# EAGLE design 7-Segment_display (EAGLE 9.6.2)
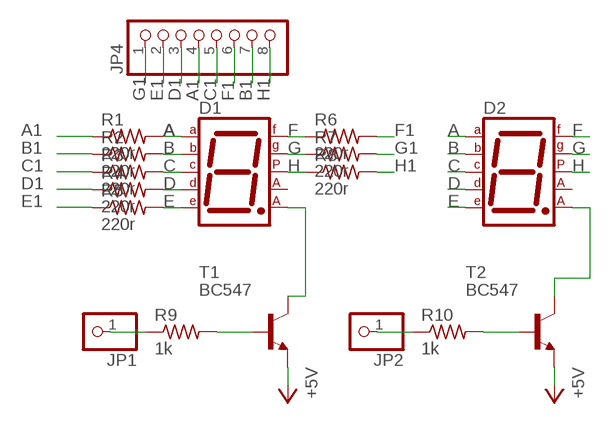
[diagram p0: schematic, sheet 1]

## Parts
D1  7SEG-CA  [7SEG-13]
D2  7SEG-CA  [7SEG-13]
JP1  PINHD-1X1  [1X01]
JP2  PINHD-1X1  [1X01]
JP4  PINHD-1X8  [1X08]
R1  220r  R-US_0207/10  [0207/10]
R2  220r  R-US_0207/10  [0207/10]
R3  220r  R-US_0207/10  [0207/10]
R4  220r  R-US_0207/10  [0207/10]
R5  220r  R-US_0207/10  [0207/10]
R6  220r  R-US_0207/10  [0207/10]
R7  220r  R-US_0207/10  [0207/10]
R8  220r  R-US_0207/10  [0207/10]
R9  1k  R-US_0207/10  [0207/10]
R10  1k  R-US_0207/10  [0207/10]
T1  BC547  [TO92]
T2  BC547  [TO92]

## Nets
+5V: T1.1(E) T2.1(E)
A: D1.7(A) D2.7(A) R1.2
A1: JP4.4 R1.1
B: D1.6(B) D2.6(B) R2.2
B1: JP4.7 R2.1
C: D1.4(C) D2.4(C) R3.2
C1: JP4.5 R3.1
D: D1.2(D) D2.2(D) R4.2
D1: JP4.3 R4.1
E: D1.1(E) D2.1(E) R5.2
E1: JP4.2 R5.1
F: D1.9(F) D2.9(F) R6.1
F1: JP4.6 R6.2
G: D1.10(G) D2.10(G) R7.1
G1: JP4.1 R7.2
H: D1.5(DP) D2.5(DP) R8.1
H1: JP4.8 R8.2
N$1: R9.2 T1.2(B)
N$2: D1.8(CA2) T1.3(C)
N$3: R10.2 T2.2(B)
N$4: D2.8(CA2) T2.3(C)
N$5: JP1.1 R9.1
N$6: JP2.1 R10.1
Unconnected: D1.3(CA1) D2.3(CA1)

## Library data of the parts
D1 D2 = special:7SEG-CA: 7-segment DISPLAY single anode, 13 mm
JP1 JP2 = pinhead:PINHD-1X1: PIN HEADER
JP4 = pinhead:PINHD-1X8: PIN HEADER
R1-R10 = rcl:R-US_: RESISTOR, American symbol; SPICEPREFIX: R
T1 T2 = transistor:BC547: NPN TRANSISTOR

## Board
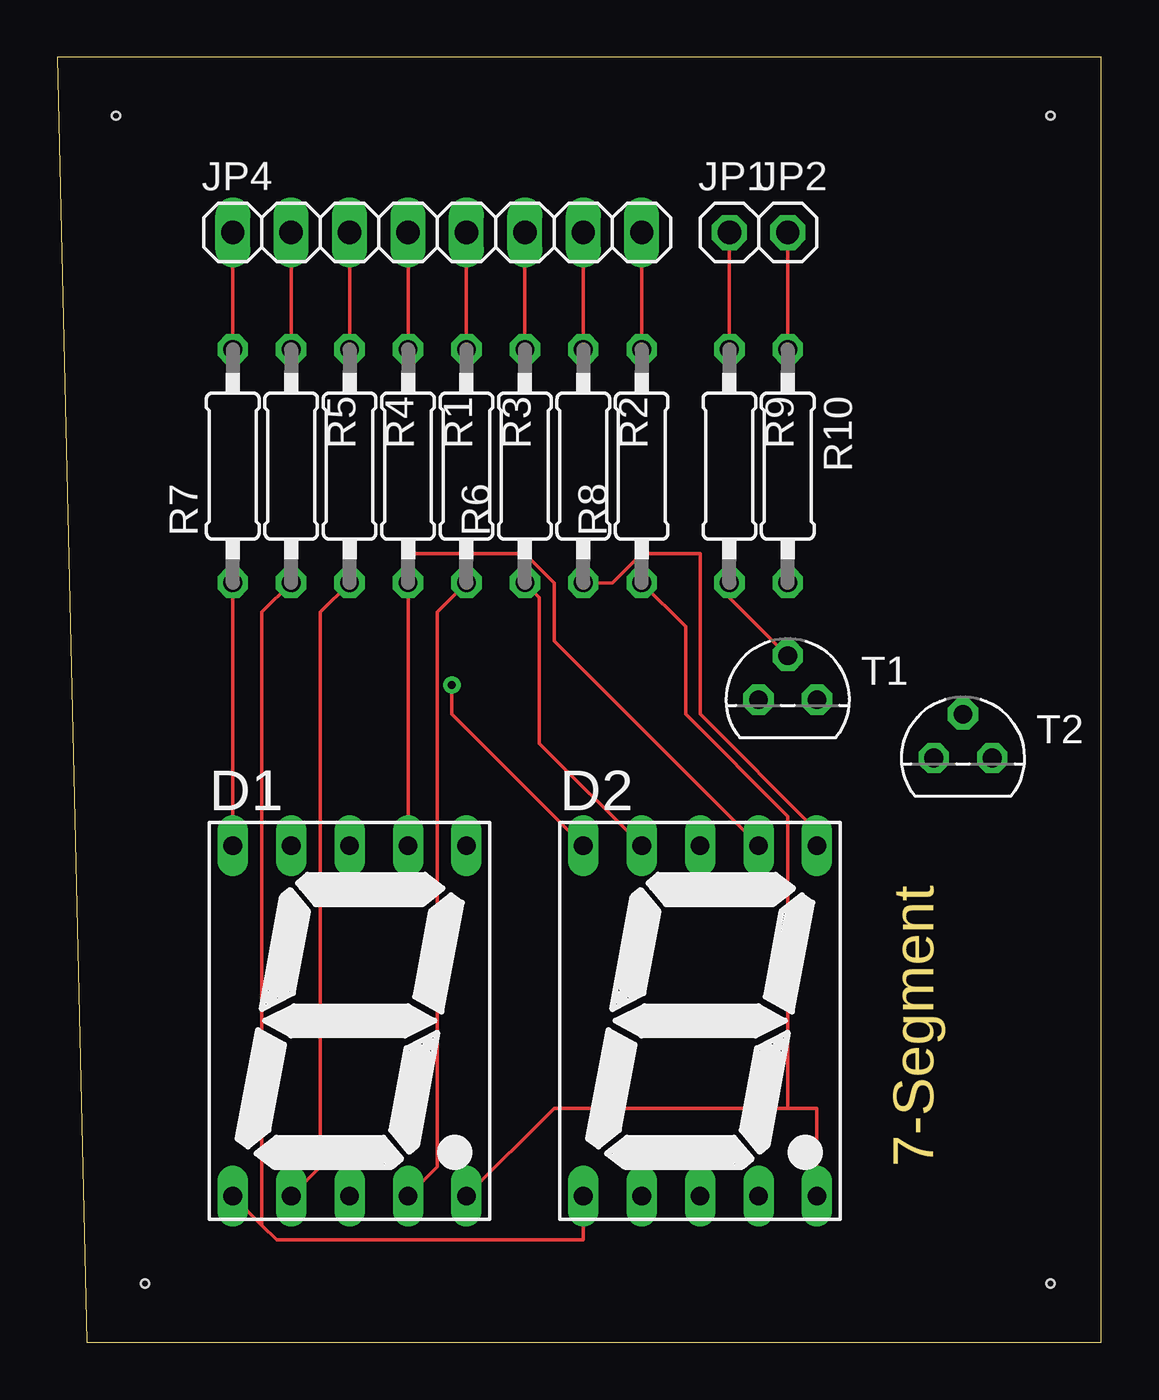
[diagram p1: board, top side]
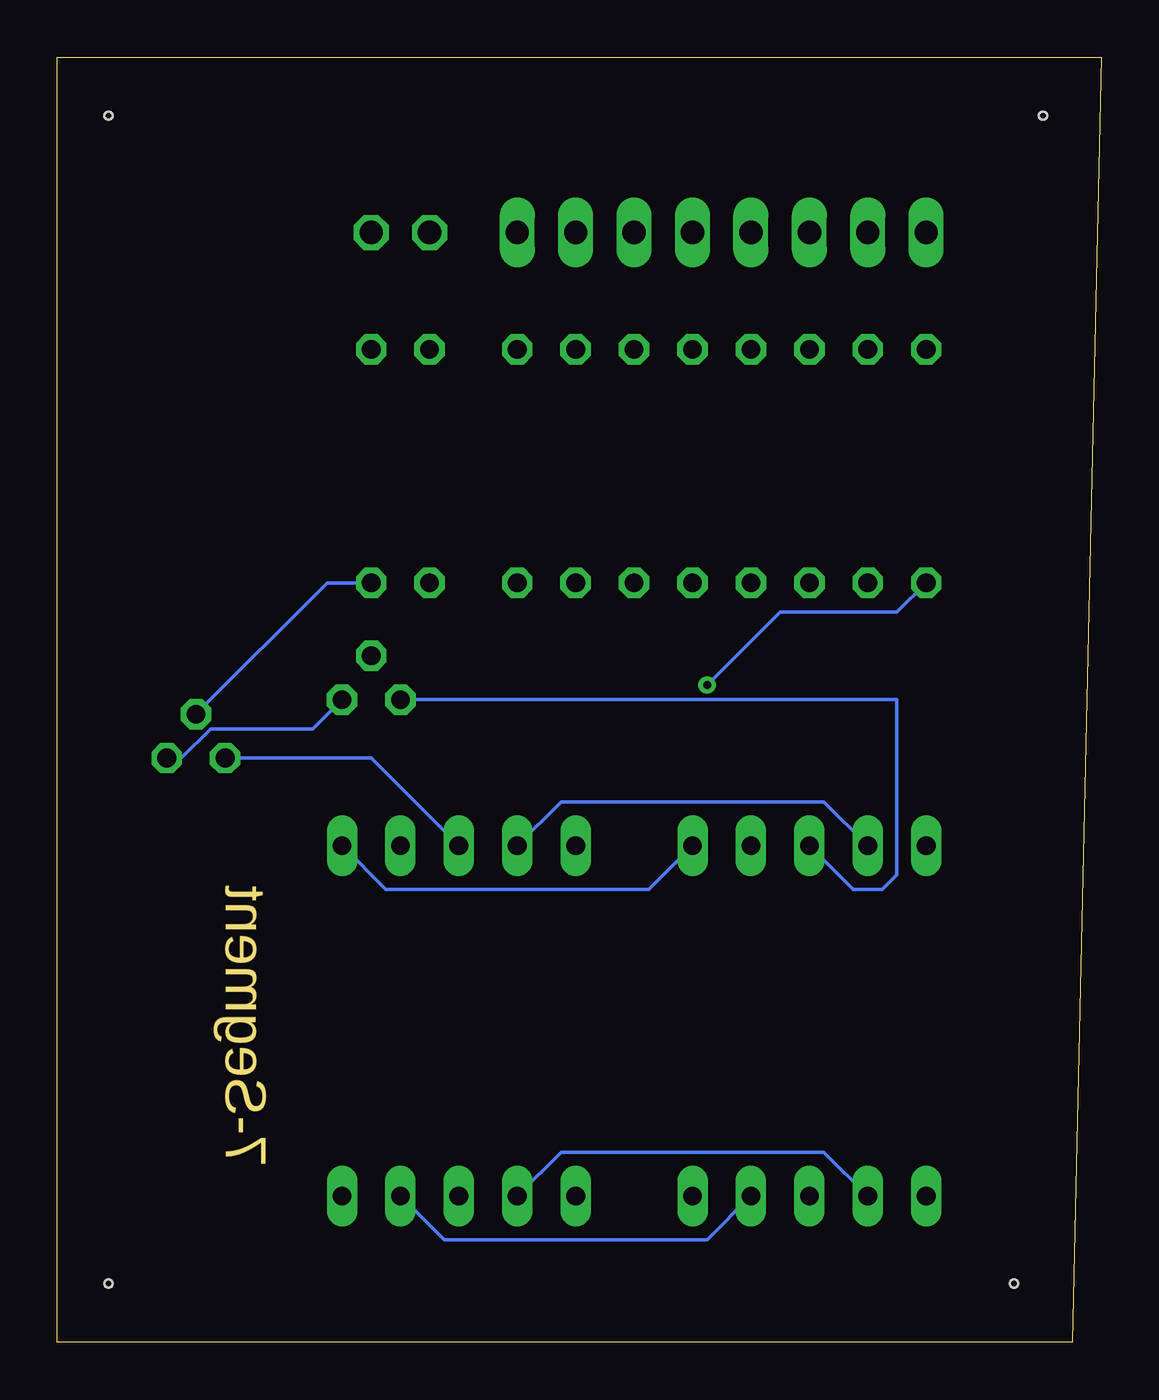
[diagram p2: board, bottom side, seen from below]

Size 45.39 x 55.87 mm. Coordinates in mm from the lower left corner, seen from the top.
Outline: 1.27,0 45.39,0 45.39,55.87 0,55.87 1.27,0
Copper layers (1*16): Top 0.035mm / dielectric 1.5mm / Bottom 0.035mm
Design rules "default": minimum track width 6mil, minimum drill 0.35mm, track to track 6mil, track to pad 6mil, pad to pad 6mil, via to via 6mil, smd to smd 6mil, copper to edge 40mil, drill to drill 6mil, minimum pad ring 10mil, minimum via ring 8mil, stop-mask expansion 4mil, vias tented up to drill 0mil, thermal gap 10mil
Holes 0.35 mm at 2.54,53.34 43.18,53.34 43.18,2.54 3.81,2.54

### Footprints (pad centres in the part's own frame; a part is rotated, then mirrored left to right if it is on the bottom)
7SEG-13 = drill 0.813 long: 1 -5.08,-7.62; 2 -2.54,-7.62; 3 0,-7.62; 4 2.54,-7.62; 5 5.08,-7.62; 6 5.08,7.62; 7 2.54,7.62; 8 0,7.62; 9 -2.54,7.62; 10 -5.08,7.62
1X01 = drill 1.016 octagon: 1 0,0
1X08 = drill 1.016 long: 1 -8.89,0; 2 -6.35,0; 3 -3.81,0; 4 -1.27,0; 5 1.27,0; 6 3.81,0; 7 6.35,0; 8 8.89,0
0207/10 = drill 0.813 octagon: 1 -5.08,0; 2 5.08,0
TO92 = drill 0.813 octagon: 1 1.27,0; 2 0,1.905; 3 -1.27,0

### Placement (x,y rotation side)
D1  12.7,13.97 0 top
D2  27.94,13.97 0 top
JP1  29.21,48.26 0 top
JP2  31.75,48.26 0 top
JP4  16.51,48.26 0 top
R1  15.24,38.1 270 top
R2  22.86,38.1 270 top
R3  17.78,38.1 270 top
R4  12.7,38.1 270 top
R5  10.16,38.1 270 top
R6  20.32,38.1 90 top
R7  7.62,38.1 90 top
R8  25.4,38.1 90 top
R9  29.21,38.1 270 top
R10  31.75,38.1 270 top
T1  31.75,27.94 0 top
T2  39.37,25.4 0 top

### Tracks (layer width: path | path; a pad name or v marks a point on that pad's centre or on a via)
+5V
  Bottom 0.152: T1.1 34.29,26.67 38.73,26.67 40,25.4 T2.1
A
  Top 0.152: D1.7 R1.2 15.24,34.29 20.32,34.29 21.59,33.02 21.59,30.48 D2.7
A1
  Top 0.152: R1.1 JP4.4
B
  Top 0.152: R2.2 24.13,33.02 25.4,34.29 27.94,34.29 27.94,27.3 33.02,22.23 D2.6
  Bottom 0.152: D1.6 19.68,19.68 31.11,19.68 D2.6
B1
  Top 0.152: R2.1 JP4.7
C
  Top 0.152: R3.2 16.51,31.75 16.51,7.62 D1.4
  Bottom 0.152: D1.4 17.14,4.44 28.57,4.44 D2.4
C1
  Top 0.152: R3.1 JP4.5
D
  Top 0.152: R4.2 11.43,31.75 11.43,7.62 D1.2
  Bottom 0.152: D1.2 12.07,8.26 23.5,8.26 D2.2
D1
  Top 0.152: R4.1 JP4.3
E
  Top 0.152: 8.89,5.08 9.53,4.44 22.86,4.44 D2.1 | 8.89,5.08 D1.1 | R5.2 8.89,31.75 8.89,5.08
E1
  Top 0.152: R5.1 JP4.2
F
  Top 0.152: R6.1 20.96,32.38 20.96,26.03 D2.9
  Bottom 0.152: D1.9 12.07,23.49 23.5,23.49 D2.9
F1
  Top 0.152: R6.2 JP4.6
G  (via drill 0.35)
  Top 0.152: R7.1 D1.10 | D2.10 17.14,27.3 v17.14,28.57
  Bottom 0.152: v17.14,28.57 13.97,31.75 8.89,31.75 R7.1
G1
  Top 0.152: R7.2 JP4.1
H
  Top 0.152: D1.5 21.59,10.16 31.75,10.16 | 31.75,10.16 33.02,10.16 D2.5 | R8.1 27.3,31.11 27.3,27.3 31.75,22.86 31.75,10.16
H1
  Top 0.152: R8.2 JP4.8
N$1
  Top 0.152: T1.2 29.21,32.38 R9.2
N$2
  Bottom 0.152: D1.8 10.79,19.68 9.53,19.68 8.89,20.32 8.89,27.94 T1.3
N$3
  Bottom 0.152: T2.2 33.66,33.02 R10.2
N$4
  Bottom 0.152: D2.8 31.75,25.4 T2.3
N$5
  Top 0.152: JP1.1 R9.1
N$6
  Top 0.152: JP2.1 R10.1

### Text on the board
Dimension: 7-Segment